# Altium schematic sheet Battery_old.SchDoc: Battery
size A4; Date: 01/12/2015; Author: Samuel López; Project: H2H Main Board
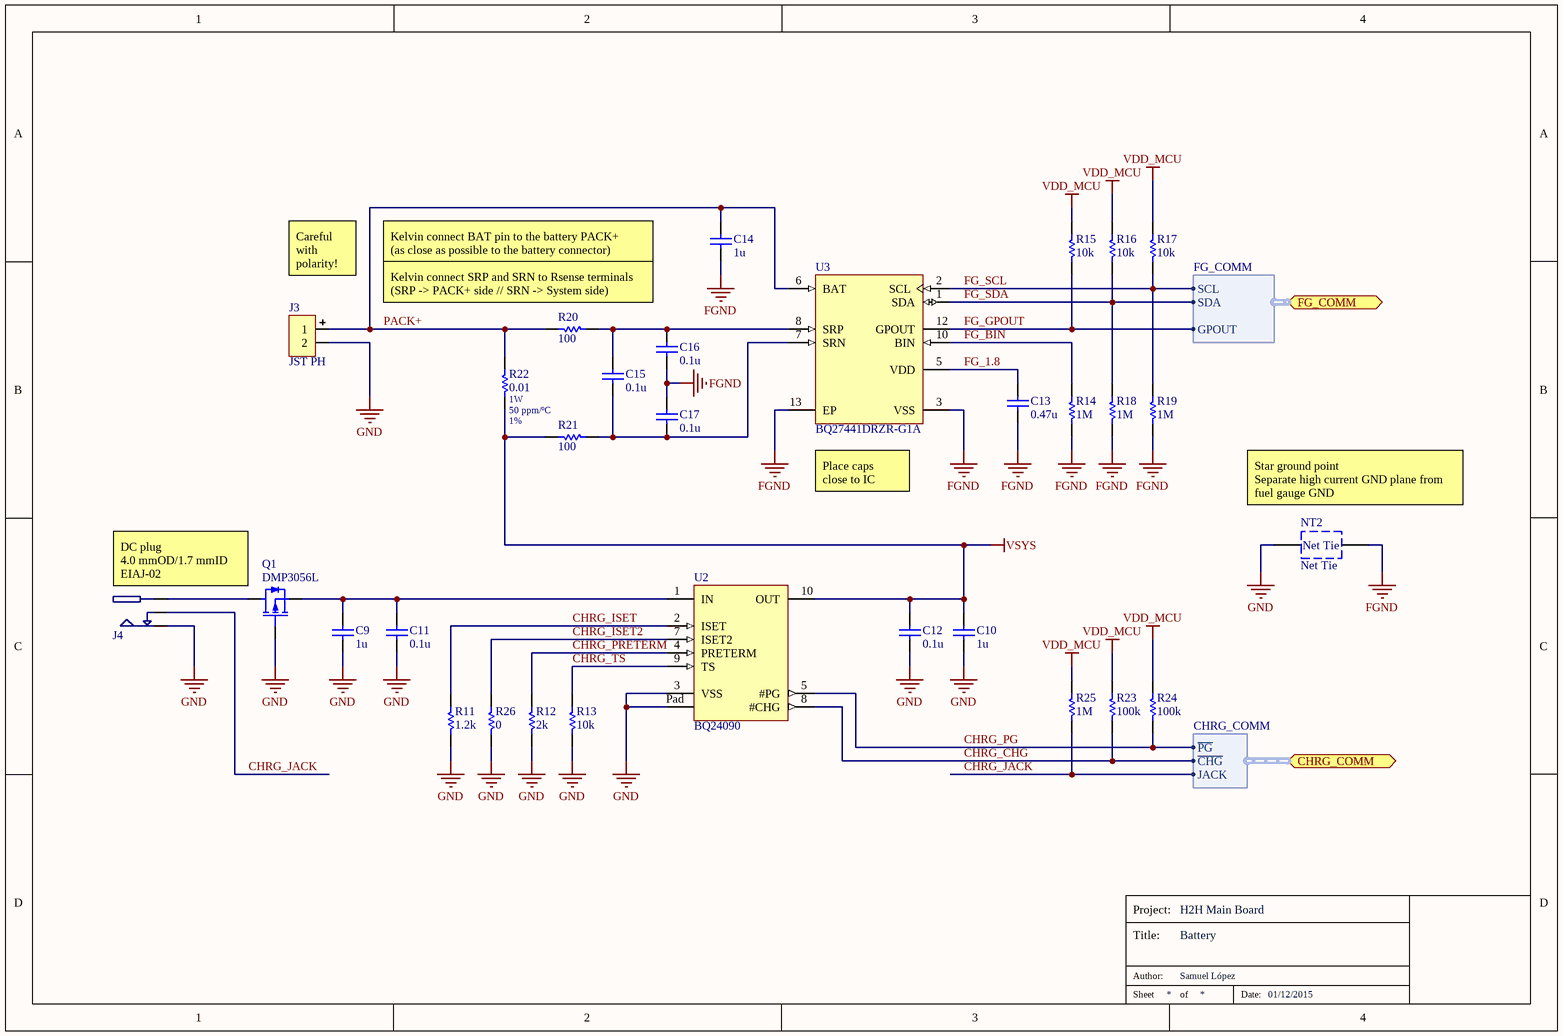
[diagram p0: Battery_old.SchDoc]

## Parts
C9  1u  [C0603]
C10  1u  [C0603]
C11  0.1u  [C0603]
C12  0.1u  [C0603]
C13  0.47u  [C0603]
C14  1u  [C0603]
C15  0.1u  [C0603]
C16  0.1u  [C0603]
C17  0.1u  [C0603]
J3  JST PH  [JST PH 2 Socket]
J4  DC Plug  [PJ-018H-SMT]  (value not drawn)
NT2  Net Tie  [Net Tie (AGND-DGND)]  (net tie, no BOM)
Q1  DMP3056L  [SSOT-3]
R11  1.2k  [R0603]
R12  2k  [R0603]
R13  10k  [R0603]
R14  1M  [R0603]
R15  10k  [R0603]
R16  10k  [R0603]
R17  10k  [R0603]
R18  1M  [R0603]
R19  1M  [R0603]
R20  100  [R0603]
R21  100  [R0603]
R22  0.01  Power: 1W  TCR: 50 ppm/ºC  Tolerance: 1%  [R1206]
R23  100k  [R0603]
R24  100k  [R0603]
R25  1M  [R0603]
R26  0  [R0603]
U2  BQ24090  [TSSOP50P490X110_HS-11N]
U3  BQ27441DRZR-G1A  [DRZ12-1950X2450TP]

## Ports
CHRG_COMM (harness CHRG_COMM), FG_COMM (harness FG_COMM)

## Harnesses
FG_COMM: SCL, SDA, GPOUT
CHRG_COMM: ~{PG}, ~{CHG}, JACK

## Nets
FGND: C13.1 C14.1 C16.1 C17.2 NT2.2 R14.1 R18.1 R19.1 U3.3(VSS) U3.13(EP)
GND: C9.1 C10.1 C11.1 C12.1 J3.2 J4.2 NT2.1 Q1.1(G) R11.1 R12.1 R13.1 R26.1 U2.3(VSS) U2.Pad(Thermal)
VDD_MCU: R15.2 R16.2 R17.2 R23.2 R24.2 R25.2
VSYS: C10.2 C12.2 R21.1 R22.2 U2.10(OUT)
CHRG_CHG: R23.1 U2.8(#CHG) ; port CHRG_COMM.~{CHG}
CHRG_ISET: R11.2 U2.2(ISET)
CHRG_ISET2: R26.2 U2.7(ISET2)
CHRG_JACK: J4.3 R25.1 ; port CHRG_COMM.JACK
CHRG_PG: R24.1 U2.5(#PG) ; port CHRG_COMM.~{PG}
CHRG_PRETERM: R12.2 U2.4(PRETERM)
CHRG_TS: R13.2 U2.9(TS)
FG_1.8: C13.2 U3.5(VDD)
FG_BIN: R14.2 U3.10(BIN)
FG_GPOUT: R15.1 U3.12(GPOUT) ; port FG_COMM.GPOUT
FG_SCL: R17.1 R19.2 U3.2(SCL) ; port FG_COMM.SCL
FG_SDA: R16.1 R18.2 U3.1(SDA) ; port FG_COMM.SDA
PACK+: C14.2 J3.1 R20.1 R22.1 U3.6(BAT)
NetC9_2: C9.2 C11.2 Q1.2(S) U2.1(IN)
NetC15_1: C15.1 C17.1 R21.2 U3.7(SRN)
NetC15_2: C15.2 C16.2 R20.2 U3.8(SRP)
NetJ4_1: J4.1 Q1.3(D)

## Notes on the sheet
- Careful with
  polarity!
- Kelvin connect BAT pin to the battery PACK+
  (as close as possible to the battery connector)
- Kelvin connect SRP and SRN to Rsense terminals
  (SRP -> PACK+ side // SRN -> System side)
- (near U3) Place caps
  close to IC
- (near NT2) Star ground point
  Separate high current GND plane from
  fuel gauge GND
- DC plug
  4.0 mmOD/1.7 mmID
  EIAJ-02
- Project:
- Title:
- Sheet
- Author:
- of
- Date:

## Library data of the parts
C9-C17 = Capacitor: Rated Voltage: *
  C9 C10 C14: Value: 1u
  C11 C12 C15-C17: Value: 0.1u
  C13: Value: 0.47u
J3 = JST PH 2 Pin Socket: Supplier 1: Digi-Key; Supplier Part Number 1: 455-1719-ND
J4 = PJ-018H-SMT: DC Power Plug - 4.0 mmOD / 1.7 mmID; Inner Diameter: 1.7 mm; Outer Diameter: 4.0 mm; DC Conn Standard: EIAJ-02; Supplier 1: Digi-Key; Supplier Part Number 1: CP-018HPJCT-ND
NT2 = Net Tie: Net Tie (AGND-DGND)
Q1 = DMP3056L: Transistor, MOSFET, P-Channel, 30V, 4.3A; RDSon @ VGS =-4.5V: 50 m; Supplier 1: Digi-Key; Supplier Part Number 1: DMP3056L-7DICT-ND
R11-R26 = Resistor
  R11: Value: 1.2k; Power: *
  R12: Value: 2k; Power: *
  R13 R15-R17: Value: 10k; Power: *
  R14 R18 R19 R25: Value: 1M; Power: *
  R20 R21: Value: 100; Power: *
  R22: Value: 0.01
  R23 R24: Value: 100k; Power: *
  R26: Value: 0; Power: *
U2 = BQ24090: Battery Charger, Single Cell Li-Ion/LiPo, 1A; Supplier 1: Digi-Key; Supplier Part Number 1: 296-38875-1-ND
U3 = BQ27441DRZR-G1A: System-Side Impedance Track Fuel Gauge, -40 to 85 degC, 12-pin SON (DRZ), Green (RoHS & no Sb/Br); PartNumber: BQ27410DRZR-G1; Manufacturer: Texas Instruments; Lead Acid: N; Li-Ion: Y; SubFamily: Battery Fuel Gauge; DatasheetVersion: SLUSAF4; PackageVersion: revB, Apr-2006; PackageReference: DRZ12-1950X2450TP; PackageDescription: 12-Pin Plastic Small Outline No-Lead, 4 x 2.5 x 1 mm Body, 0.4 mm Pitch, Exposed Pad, Pb-Free; Supplier 1: Digi-Key; Supplier Part Number 1: BQ27410DRZR-G1-ND; Supplier 2: Newark; Supplier Part Number 2: 45T7828; Supplier 3: Mouser; Supplier Part Number 3: 595-BQ27410DRZR-G1; Eco-Plan: Green (RoHS & no Sb/Br); Li-Polymer: Y; NiCd: N; NiMH: N; Over Voltage Protection: N; Mounting Technology: Surface Mount; ComponentLink1Description: Datasheet; ComponentLink1URL: http://www.ti.com/general/docs/lit/getliterature.tsp?genericPartNumber=BQ27410-G1&fileType=pdf